# EasyEDA schematic LM471-2-feb-15.json
TITLE: Sheet_1; REV: 1.0; Date: 2024-01-02; Sheet: 1/1; Company: Your Company
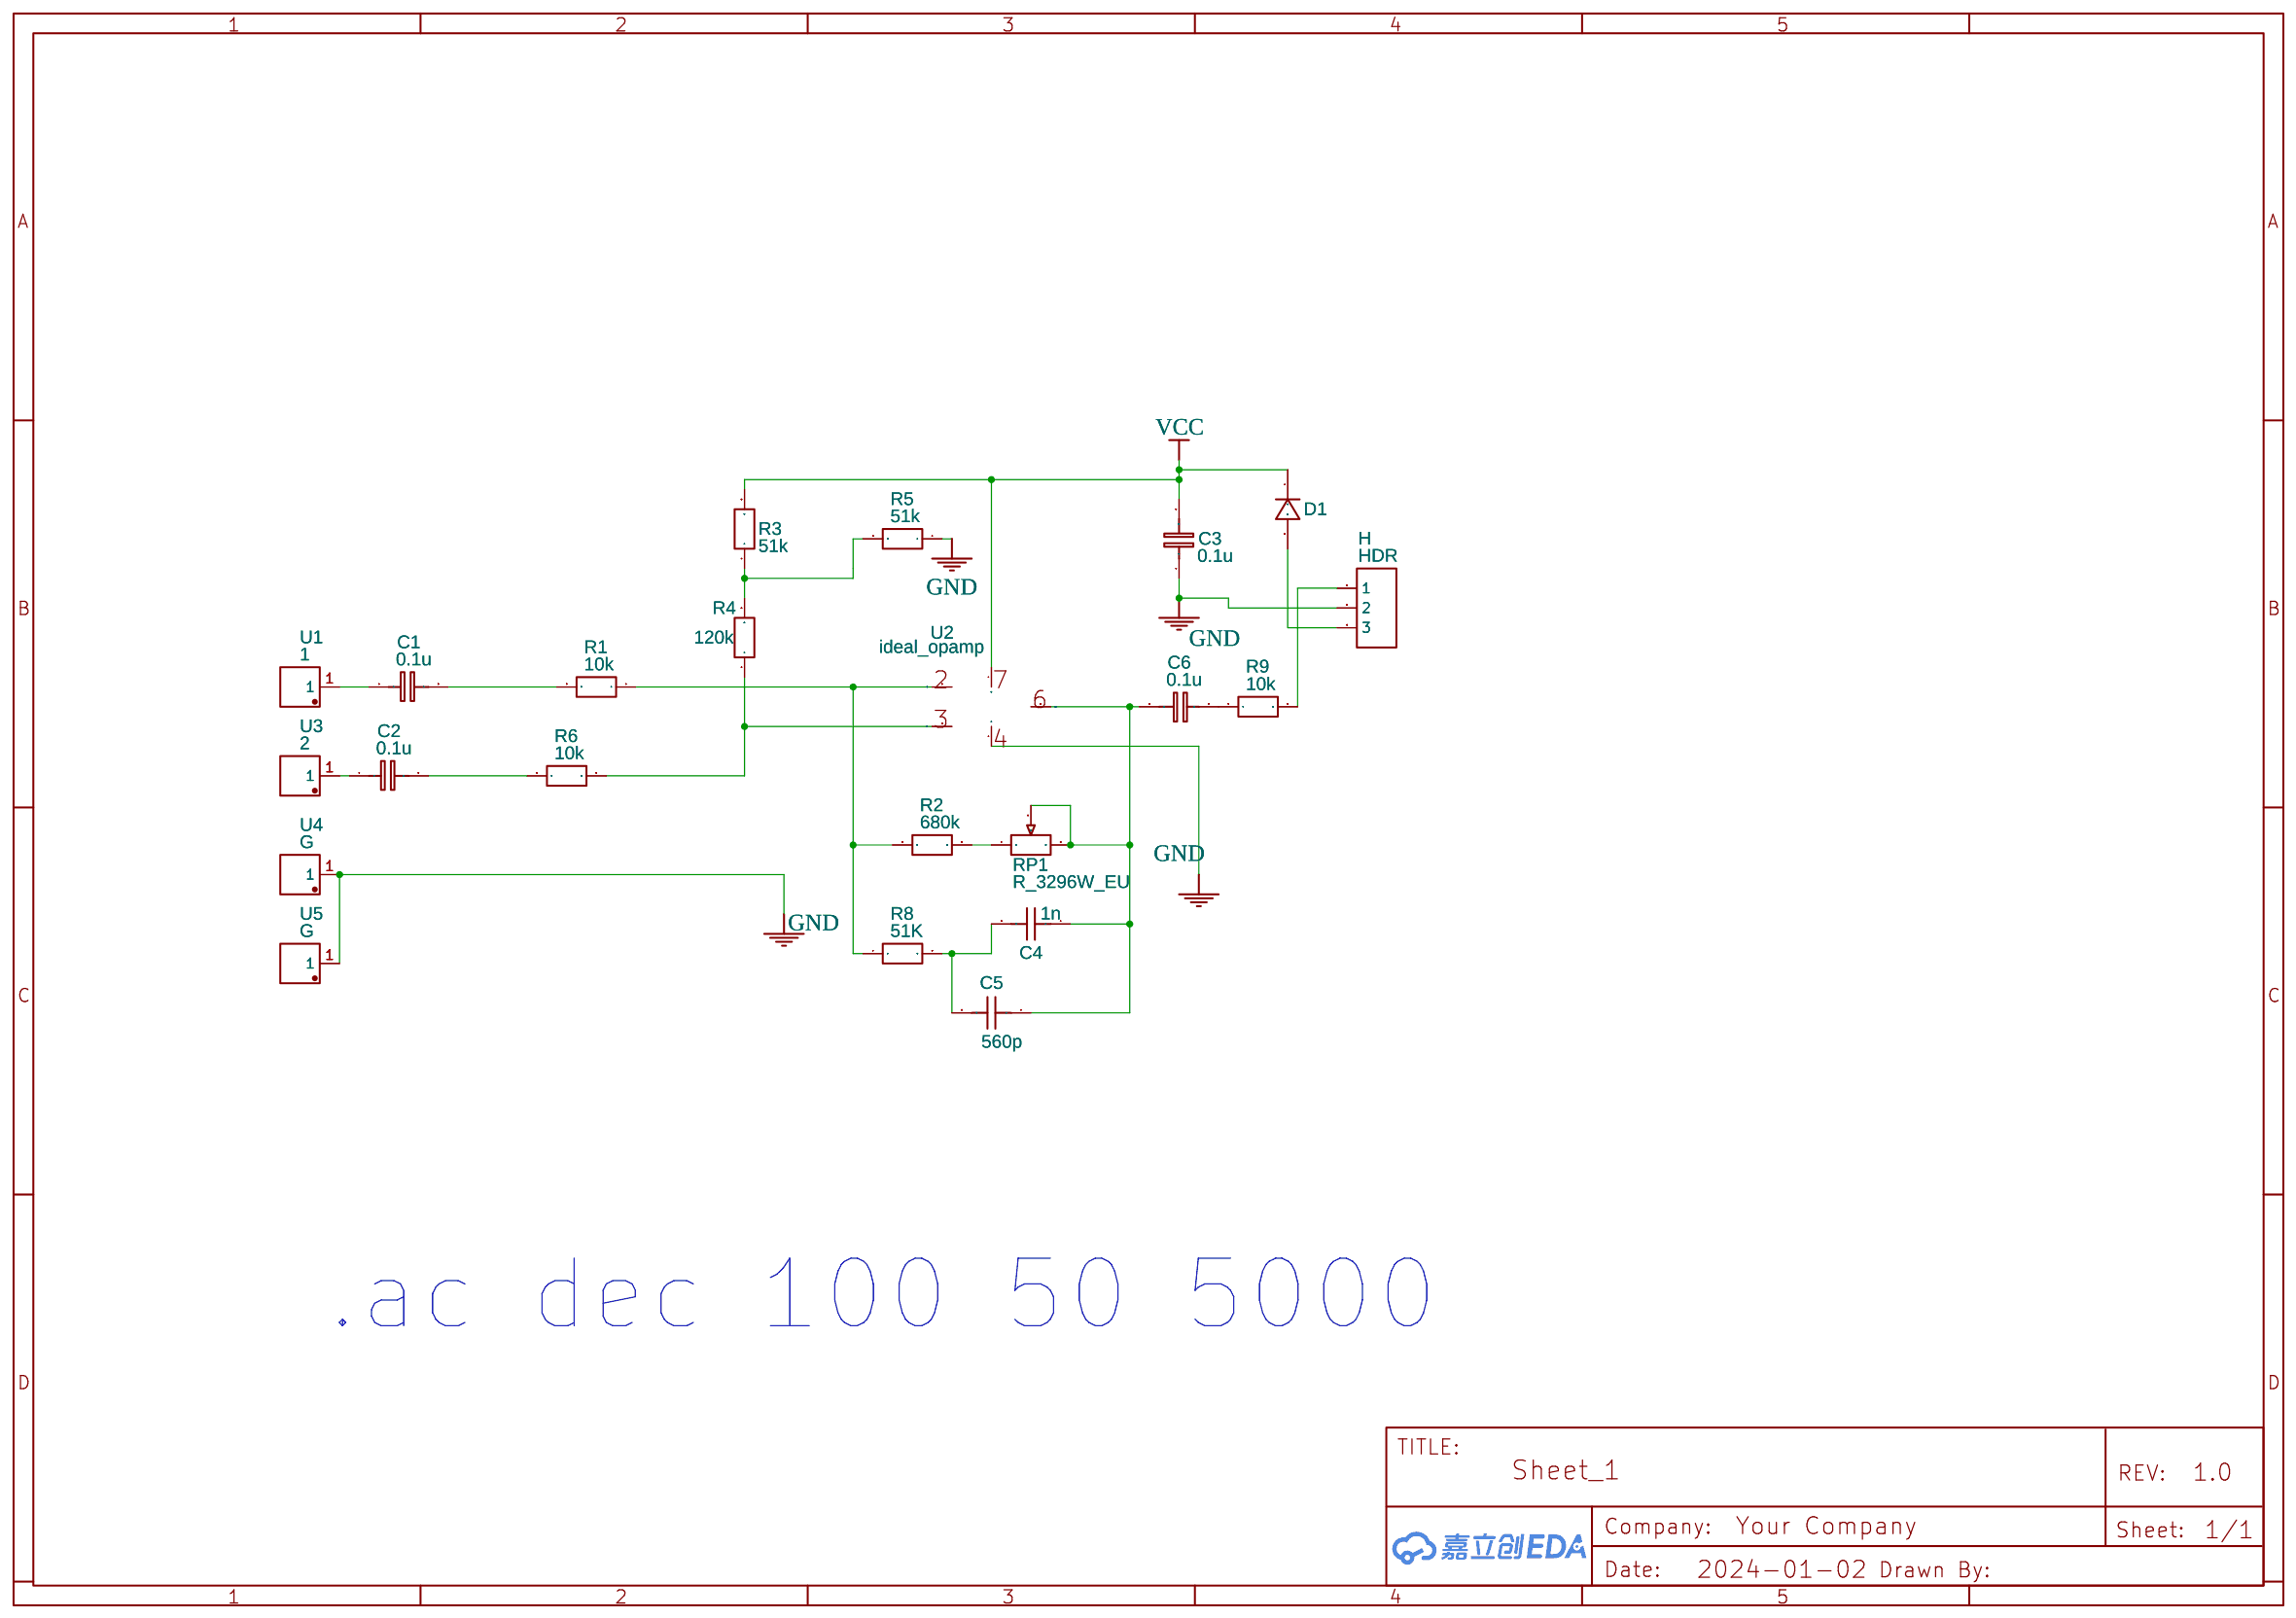
[diagram p0: schematic sheet]

## Parts
C1  0.1u  [C0603]
C2  0.1u  [C0603]
C3  0.1u  [C0603]
C4  1n  [CAPACITOR_SMD0805_HANDSOLDERING_REVA_DATE21JUN2010]
C5  560p  [CAPACITOR_SMD0805_HANDSOLDERING_REVA_DATE21JUN2010]
C6  0.1u  [C0603]
D1  1N4007W  [SOD-123_L2.8-W1.8-LS3.7-RD]
H  HDR  [HDR-F-2.54_1X3]
R1  10k  [R0603]
R2  680k  [R0603]
R3  51k  [R0603]
R4  120k  [R0603]
R5  51k  [R0603]
R6  10k  [R0603]
R8  51K  [R0603]
R9  10k  [R0603]
RP1  R_3296W_EU  [RES-ADJ-TH_RM063-103]
U1  1  [TEST-TH_BD2.54-P1.39]
U2  ideal_opamp  [TL071H]
U3  2  [TEST-TH_BD2.54-P1.39]
U4  G  [TEST-TH_BD2.54-P1.39]
U5  G  [TEST-TH_BD2.54-P1.39]

## Library data of the parts
C1-C3 C6 = C_0603_EU: Contributor: LCEDA_Lib
C4 C5 = Capacitor_US: Contributor: EasyEDA; Supplier: YUJING; Capacitance: 1u
D1 = 1N4007W: Supplier: LCSC; Supplier Part: C328592; Manufacturer: BLUE ROCKET; Contributor: LCEDA_Lib
H = HDR-F-2.54_1x3: Supplier Part: C146690; Supplier: LCSC; Contributor: LCEDA_Lib
R1-R6 R8 R9 = R_0603_EU: Contributor: LCEDA_Lib
RP1 = R_3296W_EU: Supplier: LCSC; Contributor: LCEDA_Lib; Value(Ω): 10k
U1 U3-U5 = 5001: Contributor: LCSC; Supplier: LCSC; Supplier Part: C238122; Manufacturer: Keystone; JLCPCB Part Class: Extended Part
U2 = LM741: Contributor: juan_g2; sim: true

## Nets
GND: C3.1 H.2 R5.1 U2.4(V-) U4.1 U5.1
VCC: C3.2 D1.1 R3.2 U2.7(V+)
Net-(C1-1): C1.1 U1.1
Net-(C1-2): C1.2 R1.2
Net-(C2-1): C2.1 U3.1
Net-(C2-2): C2.2 R6.2
Net-(C4-1): C4.1 C5.1 C6.2 RP1.2 RP1.3 U2.6(OUT)
Net-(C4-2): C4.2 C5.2 R8.2
Net-(C6-1): C6.1 R9.1
Net-(D1-2): D1.2 H.3
Net-(H-1): H.1 R9.2
Net-(R1-1): R1.1 R2.1 R8.1 U2.2(IN-)
Net-(R2-2): R2.2 RP1.1
Net-(R3-1): R3.1 R4.2 R5.2
Net-(R4-1): R4.1 R6.1 U2.3(IN+)

## Notes on the sheet
- .ac dec 100 50 5000
